# EAGLE design midi2cv (EAGLE 9.5.2)
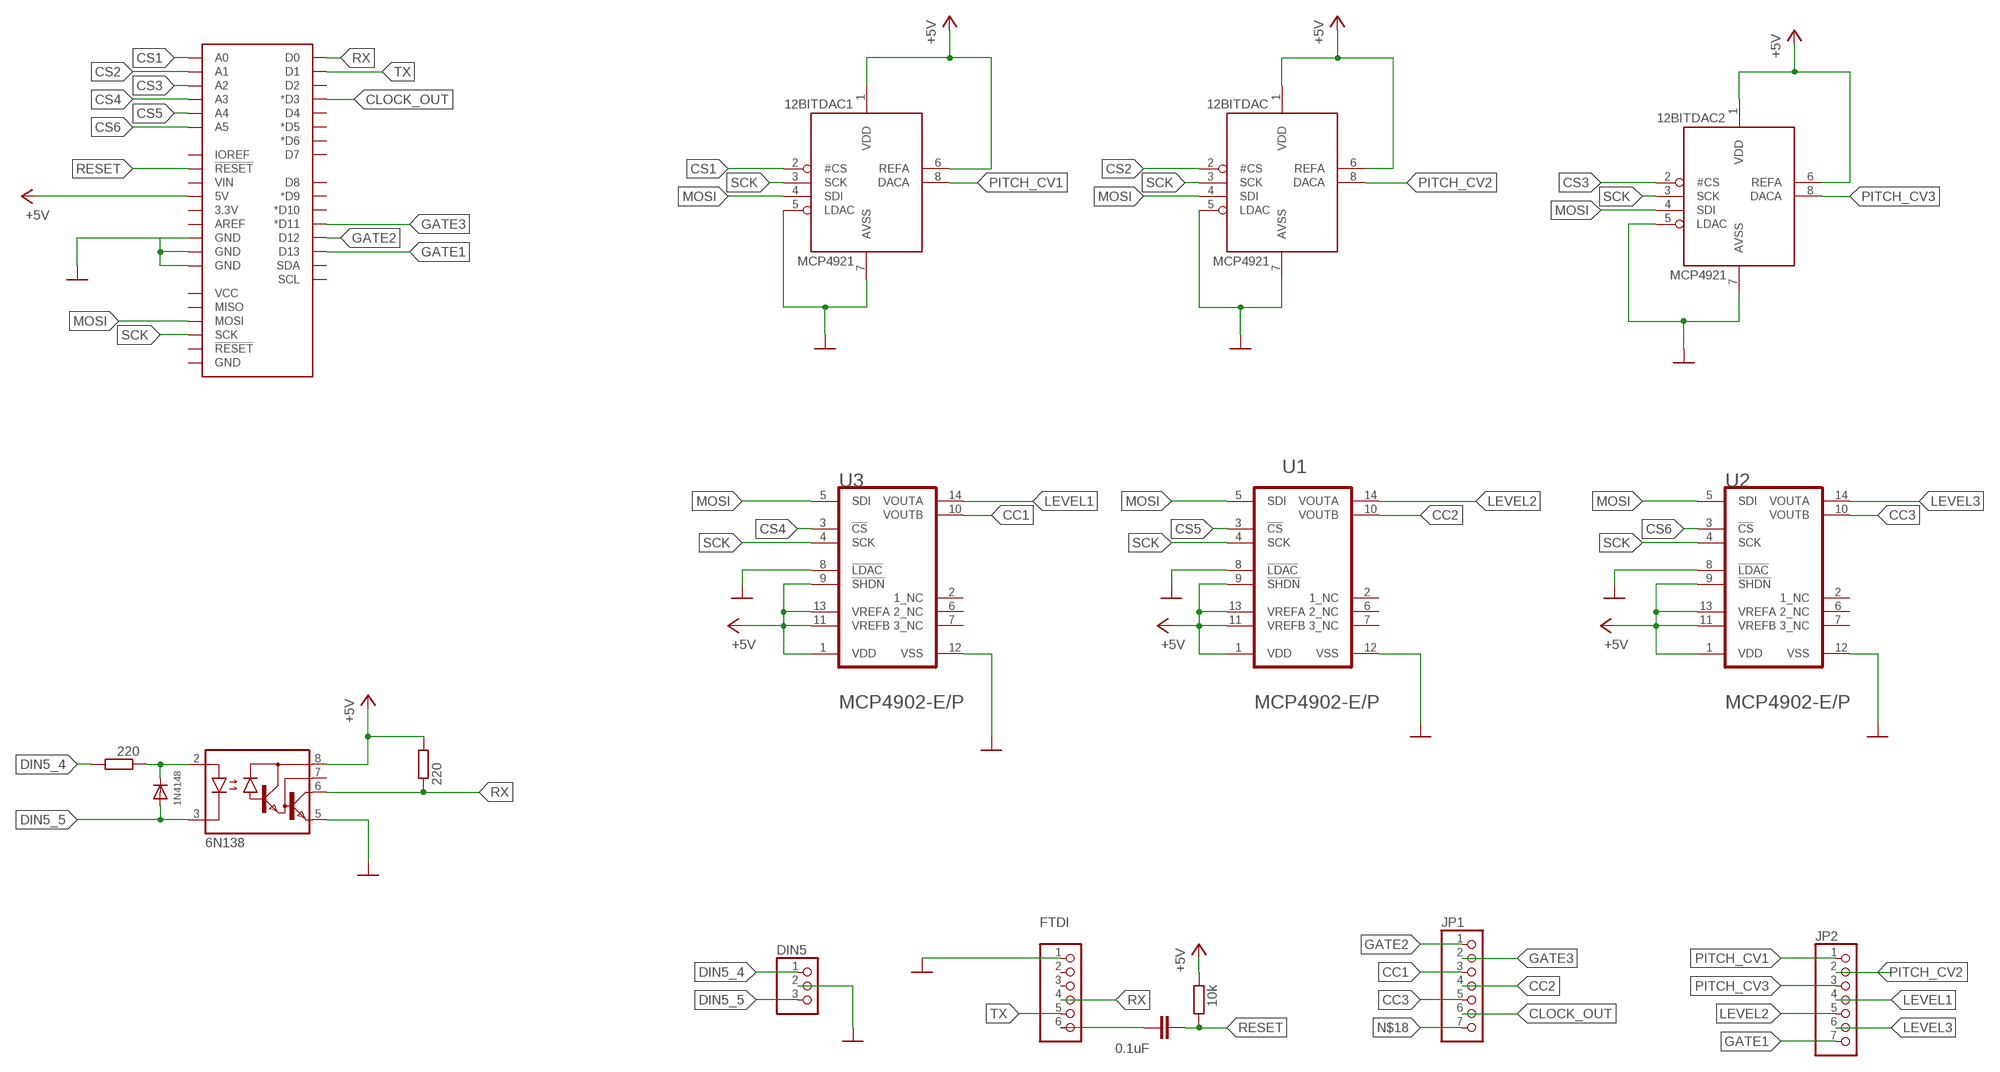
[diagram p0: schematic, sheet 1]

## Parts
12BITDAC  MCP4921  [DIL08]
12BITDAC1  MCP4921  [DIL08]
12BITDAC2  MCP4921  [DIL08]
B1  ARDUINO_UNO_R3_SHIELD_ICSP-NO_LABELS  [UNO_R3_SHIELD_ICSP_NOLABELS]
C1  0.1uF  0.1UF-KIT-EZ-50V-20%  [CAP-PTH-SMALL-KIT]
D1  1N4148  DIODEDO-1N4148  [DO-1N4148]
DIN5  PINHD-1X3  [1X03]
FTDI  PINHD-1X6  [1X06]
JP1  PINHD-1X7  [1X07]
JP2  PINHD-1X7  [1X07]
OK1  6N138  [DIL08]
R2  220  R-EU_0207/10  [0207/10]
R3  220  R-EU_0207/10  [0207/10]
R4  10k  R-EU_0207/10  [0207/10]
U1  MICROCHIP_MCP4902-E-PMICROCHIP_MCP4902-E-P_0_0  [MICROCHIP_MCP4902-E-P_0]
U2  MICROCHIP_MCP4902-E-PMICROCHIP_MCP4902-E-P_0_0  [MICROCHIP_MCP4902-E-P_0]
U3  MICROCHIP_MCP4902-E-PMICROCHIP_MCP4902-E-P_0_0  [MICROCHIP_MCP4902-E-P_0]

## Nets
+5V: 12BITDAC1.1(VDD) 12BITDAC1.6(REFA) 12BITDAC2.1(VDD) 12BITDAC2.6(REFA) 12BITDAC.1(VDD) 12BITDAC.6(REFA) B1.5V OK1.8(VCC) R2.2 R4.2 U1.1(VDD) U1.9(!SHDN!) U1.11(VREFB) U1.13(VREFA) U2.1(VDD) U2.9(!SHDN!) U2.11(VREFB) U2.13(VREFA) U3.1(VDD) U3.9(!SHDN!) U3.11(VREFB) U3.13(VREFA)
CC1: JP1.3 U3.10(VOUTB)
CC2: JP1.4 U1.10(VOUTB)
CC3: JP1.5 U2.10(VOUTB)
CLOCK_OUT: B1.D3(*D3) JP1.6
CS1: 12BITDAC1.2(#CS) B1.A0
CS2: 12BITDAC.2(#CS) B1.A1
CS3: 12BITDAC2.2(#CS) B1.A2
CS4: B1.A3 U3.3(!CS!)
CS5: B1.A4 U1.3(!CS!)
CS6: B1.A5 U2.3(!CS!)
DIN5_4: DIN5.1 R3.2
DIN5_5: D1.A DIN5.3 OK1.3(C)
GATE1: B1.D13 JP2.7
GATE2: B1.D12 JP1.1
GATE3: B1.D11(*D11) JP1.2
GND: 12BITDAC1.5(LDAC) 12BITDAC1.7(AVSS) 12BITDAC2.5(LDAC) 12BITDAC2.7(AVSS) 12BITDAC.5(LDAC) 12BITDAC.7(AVSS) B1.GND@0(GND) B1.GND@1(GND) B1.GND@2(GND) DIN5.2 FTDI.1 OK1.5(GND) U1.8(!LDAC!) U1.12(VSS) U2.8(!LDAC!) U2.12(VSS) U3.8(!LDAC!) U3.12(VSS)
LEVEL1: JP2.4 U3.14(VOUTA)
LEVEL2: JP2.5 U1.14(VOUTA)
LEVEL3: JP2.6 U2.14(VOUTA)
MOSI: 12BITDAC1.4(SDI) 12BITDAC2.4(SDI) 12BITDAC.4(SDI) B1.MOSI U1.5(SDI) U2.5(SDI) U3.5(SDI)
N$1: D1.C OK1.2(A) R3.1
N$11: C1.1 FTDI.6
N$18: JP1.7
PITCH_CV1: 12BITDAC1.8(DACA) JP2.1
PITCH_CV2: 12BITDAC.8(DACA) JP2.2
PITCH_CV3: 12BITDAC2.8(DACA) JP2.3
RESET: B1.RES(!RESET!) C1.2 R4.1
RX: B1.RX(D0) FTDI.4 OK1.6(VO) R2.1
SCK: 12BITDAC1.3(SCK) 12BITDAC2.3(SCK) 12BITDAC.3(SCK) B1.SCK U1.4(SCK) U2.4(SCK) U3.4(SCK)
TX: B1.TX(D1) FTDI.5
Unconnected: B1.3.3V B1.5V_ICSP(VCC) B1.AREF B1.D2 B1.D4 B1.D5(*D5) B1.D6(*D6) B1.D7 B1.D8 B1.D9(*D9) B1.D10(*D10) B1.GND_ICSP(GND) B1.IOREF B1.MISO B1.RST_ICSP(!RESET!) B1.SCL B1.SDA B1.VIN FTDI.2 FTDI.3 OK1.7(VB) U1.2(1_NC) U1.6(2_NC) U1.7(3_NC) U2.2(1_NC) U2.6(2_NC) U2.7(3_NC) U3.2(1_NC) U3.6(2_NC) U3.7(3_NC)

## Library data of the parts
12BITDAC 12BITDAC1 12BITDAC2 = adafruit:MCP4921
B1 = SparkFun-Boards:ARDUINO_UNO_R3_SHIELD_ICSP: Arduino R3 Shield Footprint with ICSP Header Includes pins for 6-pin (2x3) ICSP Header. Compatible with Leonardo boards that require SPI pin connections via this header. SparkFun Products: CryptoShield <https://www.sparkfun.com/products/13183> microSD Shield <https://www.sparkfun.com/products/12761> R3 Stackable Headers Kit <https://www.sparkfun.com/products/1417>
C1 = SparkFun-RF:0.1UF: 0.1µF ceramic capacitors A capacitor is a passive two-terminal electrical component used to store electrical energy temporarily in an electric field.; PROD_ID: CAP-08370
D1 = adafruit:DIODE: Diode SMADIODE - SMA Surface Mount Package 20V 1A Schottky Diode Digikey: 641-1014-6-ND DO-1N4148 - Through Hole Small Current Diode SOD-123 20V 1 A (.5mV Vf) Schottky Diode - Digikey: MBRX120TPMSCT-ND SOD-323 10V 570mA (.38mV Vf, 3ns) Schottky Diode - Digikey: ZLLS410CT-ND SOD-523 30V 30mA Schottky Diode (RB751S-40TE61) - Digikey: RB751S-40TE61CT-ND SOT23-R/W - SOT23 Package (R = Solder Paste/Reflow Ovens, W = Hand-Soldering) BAT54Film 40V 300mA - Digikey: 497-7162-1-ND
DIN5 = pinhead:PINHD-1X3: PIN HEADER
FTDI = pinhead:PINHD-1X6: PIN HEADER
JP1 JP2 = pinhead:PINHD-1X7: PIN HEADER
OK1 = optocoupler:6N138: MOTOROLA OPTO COUPLER; MF: VISHAY/TELEFUNKEN; MPN: 6N138; OC_FARNELL: 9860150; OC_NEWARK: 35K5294
R2-R4 = rcl:R-EU_: RESISTOR, European symbol; SPICEPREFIX: R
U1-U3 = P:MICROCHIP_MCP4902-E-P: CON-DAC-MCP4922-14; CIIVA_IDS: 1090777; COMPONENT_LINK_1_DESCRIPTION: Manufacturer URL; COMPONENT_LINK_1_URL: http://www.microchip.com/; COMPONENT_LINK_3_DESCRIPTION: Package Specification; COMPONENT_LINK_3_URL: http://www.microchip.com/stellent/groups/techpub_sg/documents/packagingspec/en012702.pdf; DATASHEET: http://ww1.microchip.com/downloads/en/DeviceDoc/22250A.pdf; DATASHEET_VERSION: revA, Apr-2010; FOOTPRINT_VARIANT_NAME_0: Manufacturer Recommended; IMPORTED: yes; IMPORTED_FROM: vault; IMPORT_TS: 1521852505; MF: Microchip; MPN: MCP4902-E/P; PACKAGE: PDIP300-P14; PACKAGE_DESCRIPTION: 14-Lead Plastic Dual In-Line (P) - 300 mil Body [PDIP]; PACKAGE_VERSION: revBB, Aug-2009; PIN_0_0_3_INSIDE_EDGE: clock; PREFIX: U; RELEASE_DATE: 1331947828; VAULT_GUID: 3A7014CA-5924-4952-8BDA-92187A8636D2; VAULT_REVISION: B72574DA-9240-4C5E-93DF-B1241348D387

## Board
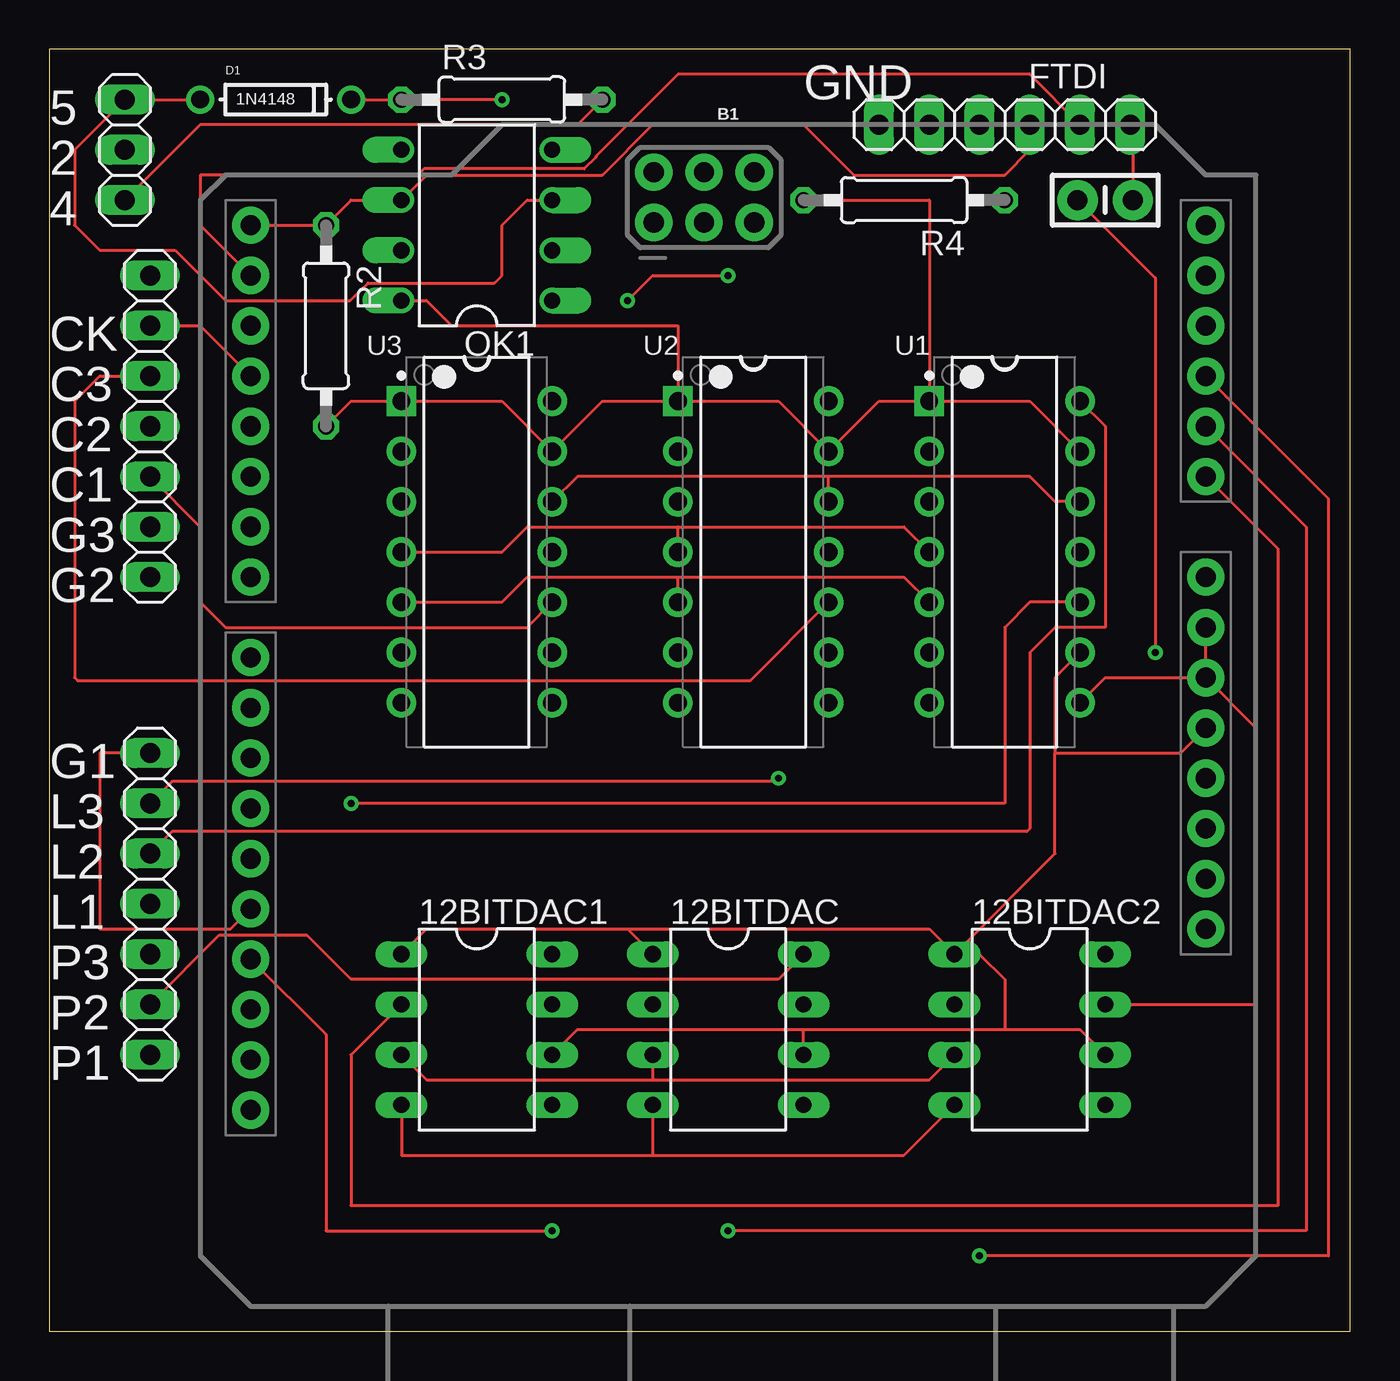
[diagram p1: board, top side]
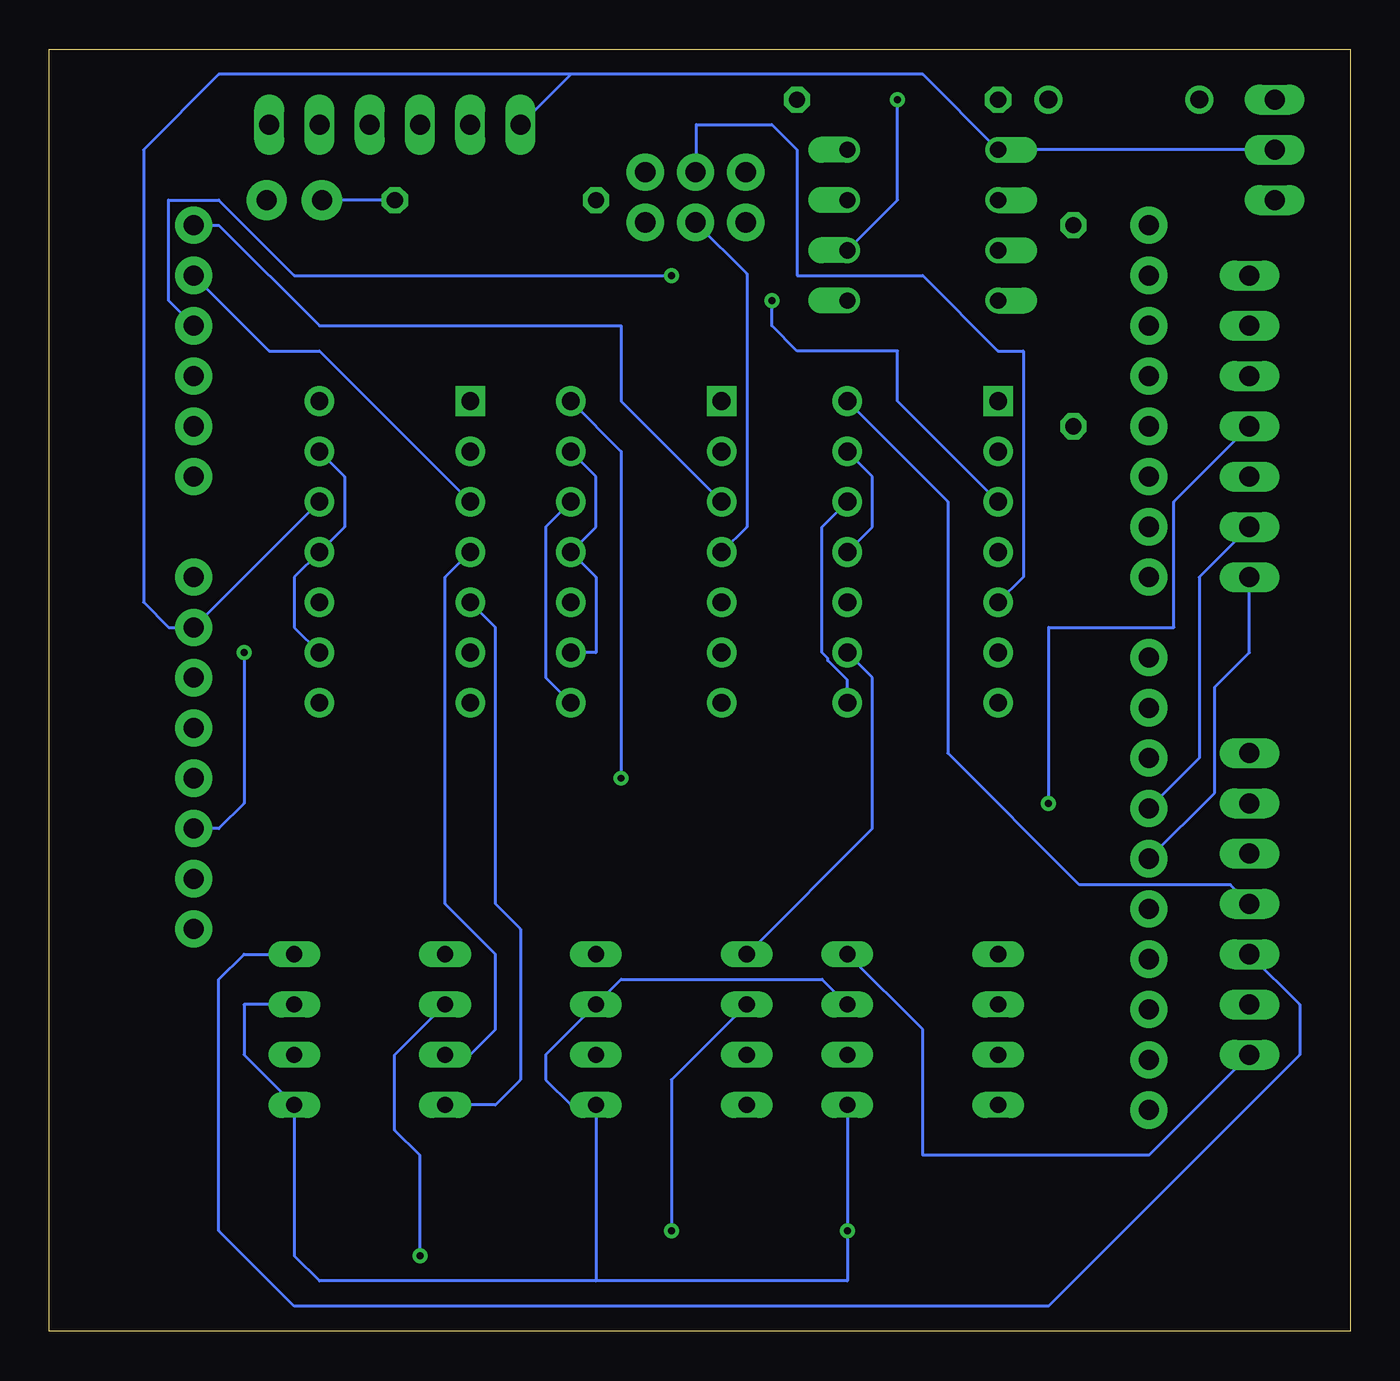
[diagram p2: board, bottom side, seen from below]

Size 65.71 x 64.76 mm. Coordinates in mm from the lower left corner, seen from the top.
Outline: 0,0 65.71,0 65.71,64.76 0,64.76 0,0
Copper layers (1*16): Top 0.035mm / dielectric 1.5mm / Bottom 0.035mm
Design rules "default": minimum track width 6mil, minimum drill 0.35mm, track to track 6mil, track to pad 6mil, pad to pad 6mil, via to via 6mil, smd to smd 6mil, copper to edge 40mil, drill to drill 6mil, minimum pad ring 10mil, minimum via ring 8mil, stop-mask expansion 4mil, vias tented up to drill 0mil, thermal gap 10mil

### Footprints (pad centres in the part's own frame; a part is rotated, then mirrored left to right if it is on the bottom)
DIL08 = drill 0.813 long: 1 -3.81,-3.81; 2 -1.27,-3.81; 3 1.27,-3.81; 4 3.81,-3.81; 5 3.81,3.81; 6 1.27,3.81; 7 -1.27,3.81; 8 -3.81,3.81
UNO_R3_SHIELD_ICSP_NOLABELS = drill 1.016 pad 1.88: 3.3V 24.13,-3.81; 5V 24.13,-1.27; 5V_ICSP -3.76,26.81; A0 24.13,11.43; A1 24.13,13.97; A2 24.13,16.51; A3 24.13,19.05; A4 24.13,21.59; A5 24.13,24.13; AREF -24.13,-15.494; D2 -24.13,19.05; D3 -24.13,16.51; D4 -24.13,13.97; D5 -24.13,11.43; D6 -24.13,8.89; D7 -24.13,6.35; D8 -24.13,2.286; D9 -24.13,-0.254; D10 -24.13,-2.794; D11 -24.13,-5.334; D12 -24.13,-7.874; D13 -24.13,-10.414; GND@0 24.13,1.27; GND@1 24.13,3.81; GND@2 -24.13,-12.954; GND_ICSP 1.32,26.81; IOREF 24.13,-8.89; MISO -3.76,24.27; MOSI -1.22,26.81; NC 24.13,-11.43; RES 24.13,-6.35; RST_ICSP 1.32,24.27; RX -24.13,24.13; SCK -1.22,24.27; SCL -24.13,-20.574; SDA -24.13,-18.034; TX -24.13,21.59; VIN 24.13,6.35
CAP-PTH-SMALL-KIT = drill 1.016 pad 2.032: 1 -1.397,0; 2 1.397,0
DO-1N4148 = drill 0.9: A -3.81,0; C 3.81,0
1X03 = drill 1.016 long: 1 -2.54,0; 2 0,0; 3 2.54,0
1X06 = drill 1.016 long: 1 -6.35,0; 2 -3.81,0; 3 -1.27,0; 4 1.27,0; 5 3.81,0; 6 6.35,0
1X07 = drill 1.016 long: 1 -7.62,0; 2 -5.08,0; 3 -2.54,0; 4 0,0; 5 2.54,0; 6 5.08,0; 7 7.62,0
DIL08' = drill 0.813 offset: 1 -3.81,-3.81; 2 -1.27,-3.81; 3 1.27,-3.81; 4 3.81,-3.81; 5 3.81,3.81; 6 1.27,3.81; 7 -1.27,3.81; 8 -3.81,3.81
0207/10 = drill 0.813 octagon: 1 -5.08,0; 2 5.08,0
MICROCHIP_MCP4902-E-P_0 = drill 0.9 pad 1.5 square: 1 -3.81,7.62 | drill 0.9 pad 1.5: 2 -3.81,5.08; 3 -3.81,2.54; 4 -3.81,0; 5 -3.81,-2.54; 6 -3.81,-5.08; 7 -3.81,-7.62; 8 3.81,-7.62; 9 3.81,-5.08; 10 3.81,-2.54; 11 3.81,0; 12 3.81,2.54; 13 3.81,5.08; 14 3.81,7.62

### Placement (x,y rotation side)
12BITDAC  34.29,15.24 270 top
12BITDAC1  21.59,15.24 270 top
12BITDAC2  49.53,15.24 270 top
B1  34.29,31.75 0 top
C1  53.34,57.15 180 top
D1  11.43,62.23 0 top
DIN5  3.81,59.69 90 top
FTDI  48.26,60.96 0 top
JP1  5.08,45.72 90 top
JP2  5.08,21.59 90 top
OK1  6N138  [DIL08']  21.59,55.88 90 top
R2  13.97,50.8 270 top
R3  22.86,62.23 0 top
R4  43.18,57.15 180 top
U1  48.26,39.37 0 top
U2  35.56,39.37 0 top
U3  21.59,39.37 0 top

### Tracks (layer width: path | path; a pad name or v marks a point on that pad's centre or on a via)
+5V
  Top 0.152: 12BITDAC1.6 26.67,15.24 38.1,15.24 | 12BITDAC2.6 52.07,15.24 48.26,15.24 | 38.1,15.24 48.26,15.24 | 12BITDAC.6 38.1,15.24 | 12BITDAC2.1 46.99,19.05 48.26,17.78 48.26,15.24 | 12BITDAC1.1 19.05,20.32 29.21,20.32 | 29.21,20.32 12BITDAC.1 | 29.21,20.32 44.45,20.32 12BITDAC2.1 | U1.9 50.8,33.02 50.8,29.21 | 50.8,29.21 57.15,29.21 B1.5V | R2.2 15.24,46.99 U3.1 22.86,46.99 U3.13 27.94,46.99 U2.1 | U2.1 36.83,46.99 U2.13 41.91,46.99 U1.1 | U1.1 49.53,46.99 U1.13 | R4.2 44.45,57.15 U1.1 | 12BITDAC2.1 50.8,24.13 50.8,29.21 | OK1.8 19.05,52.07 20.32,50.8 31.75,50.8 U2.1
  Bottom 0.152: 12BITDAC.1 24.13,25.4 24.13,33.02 U3.9 | U1.9 53.34,35.56 53.34,38.1 U1.11 50.8,40.64 50.8,43.18 U1.13 | U2.9 38.1,34.29 38.1,38.1 U2.11 38.1,40.64 38.1,43.18 U2.13 | U3.11 24.13,40.64 24.13,43.18 U3.13
CC1
  Top 0.152: U3.10 24.13,35.56 8.89,35.56 7.62,36.83 7.62,40.64 JP1.3
CC2  (via drill 0.35)
  Top 0.152: U1.10 49.53,36.83 48.26,35.56 48.26,26.67 v15.24,26.67
  Bottom 0.152: v15.24,26.67 15.24,35.56 8.89,35.56 8.89,41.91 JP1.4
CC3
  Top 0.152: JP1.5 2.54,48.26 1.27,46.99 1.27,33.02 1.42,32.87 35.41,32.87 U2.10
CLOCK_OUT
  Top 0.152: JP1.6 7.62,50.8 B1.D3
CS1
  Top 0.152: 12BITDAC1.2 15.24,13.97 15.24,6.35 62.08,6.35 62.08,39.52 B1.A0
CS2  (via drill 0.35)
  Top 0.152: B1.A1 63.5,40.64 63.5,5.08 v34.29,5.08
  Bottom 0.152: 12BITDAC.2 34.29,12.7 v34.29,5.08
CS3  (via drill 0.35)
  Top 0.152: B1.A2 64.62,42.06 64.62,3.81 v46.99,3.81
  Bottom 0.152: v46.99,3.81 46.99,8.89 48.26,10.16 48.26,13.97 12BITDAC2.2
CS4  (via drill 0.35)
  Top 0.152: v29.21,52.07 30.48,53.34 v34.29,53.34
  Bottom 0.152: U3.3 22.86,46.99 22.86,49.53 27.94,49.53 29.21,50.8 v29.21,52.07 | B1.A3 59.69,52.07 59.69,57.15 57.15,57.15 53.34,53.34 v34.29,53.34
CS5
  Bottom 0.152: U1.3 52.07,49.53 54.61,49.53 B1.A4
CS6
  Bottom 0.152: B1.A5 57.15,55.88 52.07,50.8 36.83,50.8 36.83,46.99 U2.3
DIN5_4
  Top 0.152: R3.2 26.67,60.96 7.62,60.96 DIN5.1
DIN5_5
  Top 0.152: D1.A DIN5.3 1.27,59.69 1.27,55.88 2.54,54.61 6.35,54.61 8.89,52.07 15.2,52.07 16.09,52.96 22.48,52.96 22.86,53.34 22.86,55.88 24.13,57.15 OK1.3
GATE1
  Top 0.152: JP2.7 2.54,29.21 2.54,20.32 9.14,20.32 B1.D13
GATE2
  Bottom 0.152: JP1.1 5.08,34.29 6.83,32.54 6.83,27.2 B1.D12
GATE3
  Bottom 0.152: B1.D11 7.62,28.96 7.62,38.1 JP1.2
GND  (via drill 0.35)
  Top 0.152: 12BITDAC2.7 60.96,16.51 60.96,30.48 B1.GND@0 | B1.GND@0 B1.GND@1 | U1.8 53.34,33.02 B1.GND@0 | U1.12 50.8,41.91 49.53,43.18 39.37,43.18 | 39.37,43.18 26.67,43.18 U3.12 | U2.12 39.37,43.18 | B1.GND@2 13.97,14.99 13.97,5.08 v25.4,5.08
  Bottom 0.152: 12BITDAC1.5 v25.4,5.08 25.4,2.54 38.1,2.54 | 38.1,2.54 52.07,2.54 53.34,3.81 12BITDAC2.5 55.88,13.97 55.88,16.51 12BITDAC2.7 | 38.1,2.54 12BITDAC.5 39.37,11.43 40.64,12.7 40.64,13.97 12BITDAC.7 36.83,17.78 26.67,17.78 12BITDAC1.7 | U3.8 25.4,32.91 26.38,33.88 26.38,34 26.67,34.29 26.67,40.64 U3.12 | U2.12 40.64,40.64 40.64,33.02 U2.8 | DIN5.2 OK1.5 21.59,63.5 39.37,63.5 | FTDI.1 39.37,63.5 | 39.37,63.5 57.15,63.5 60.96,59.69 60.96,36.83 59.69,35.56 B1.GND@1 U1.12
LEVEL1
  Bottom 0.152: U3.14 20.32,41.91 20.32,29.21 13.66,22.55 6.05,22.55 JP2.4
LEVEL2
  Top 0.152: U1.14 53.34,45.72 53.34,35.56 50.8,35.56 49.53,34.29 49.53,25.4 49.38,25.25 6.2,25.25 JP2.5
LEVEL3  (via drill 0.35)
  Top 0.152: v36.83,27.94 36.83,27.79 6.2,27.79 JP2.6
  Bottom 0.152: U2.14 36.83,44.45 v36.83,27.94
MOSI
  Top 0.152: 12BITDAC1.4 17.78,8.89 30.48,8.89 | 30.48,8.89 43.18,8.89 12BITDAC2.4 | 12BITDAC.4 30.48,8.89 | U3.5 22.86,36.83 24.13,38.1 31.75,38.1 | 31.75,38.1 43.18,38.1 U1.5 | U2.5 31.75,38.1
  Bottom 0.152: 12BITDAC2.4 43.18,11.43 41.91,12.7 41.91,20.32 43.18,21.59 43.18,35.56 U1.5 | U3.5 16.51,38.1 16.51,49.53 17.78,49.53 21.59,53.34 27.94,53.34 27.94,59.69 29.21,60.96 33.02,60.96 33.02,58.61 B1.MOSI
N$1  (via drill 0.35)
  Top 0.152: D1.C R3.1 v22.86,62.23
  Bottom 0.152: OK1.2 22.86,57.15 v22.86,62.23
N$11
  Top 0.152: FTDI.6 54.74,60.83 C1.1
PITCH_CV1
  Bottom 0.152: JP2.1 10.16,8.89 21.59,8.89 21.59,15.24 12BITDAC1.8
PITCH_CV2
  Top 0.152: JP2.2 8.59,20.02 13.01,20.02 15.24,17.78 36.83,17.78 12BITDAC.8
PITCH_CV3
  Bottom 0.152: JP2.3 2.54,16.51 2.54,13.97 15.24,1.27 53.34,1.27 57.15,5.08 57.15,17.78 55.88,19.05 12BITDAC2.8
RESET  (via drill 0.35)
  Top 0.152: C1.2 55.88,53.21 v55.88,34.29
  Bottom 0.152: R4.1 C1.2 | v55.88,34.29 55.88,26.67 57.15,25.4 B1.RES
RX
  Top 0.152: B1.RX R2.1 15.24,57.15 OK1.6 19.05,58.42 27.94,58.42 30.48,60.96 38.1,60.96 40.64,58.42 48.26,58.42 49.53,59.69 FTDI.4
SCK
  Top 0.152: 12BITDAC1.3 19.05,12.7 30.48,12.7 | 12BITDAC2.3 44.45,12.7 30.48,12.7 | 12BITDAC.3 30.48,12.7 | U3.4 22.86,39.37 24.13,40.64 31.75,40.64 | 31.75,40.64 43.18,40.64 U1.4 | U2.4 31.75,40.64
  Bottom 0.152: 12BITDAC2.3 44.45,13.97 43.18,15.24 43.18,19.05 45.72,21.59 45.72,38.1 U1.4 | B1.SCK 30.48,53.43 30.48,40.64 U2.4
TX
  Top 0.152: FTDI.5 49.53,63.5 31.75,63.5 27.61,59.36 27.61,59.32 27.01,58.73 18.92,58.73 18.62,58.42 7.62,58.42 7.62,55.88 B1.TX

### Text on the board
tPlace: GND | 5 | 2 | 4 | CK | C3 | C2 | C1 | G3 | G2 | G1 | L3 | L2 | L1 | P3 | P2 | P1